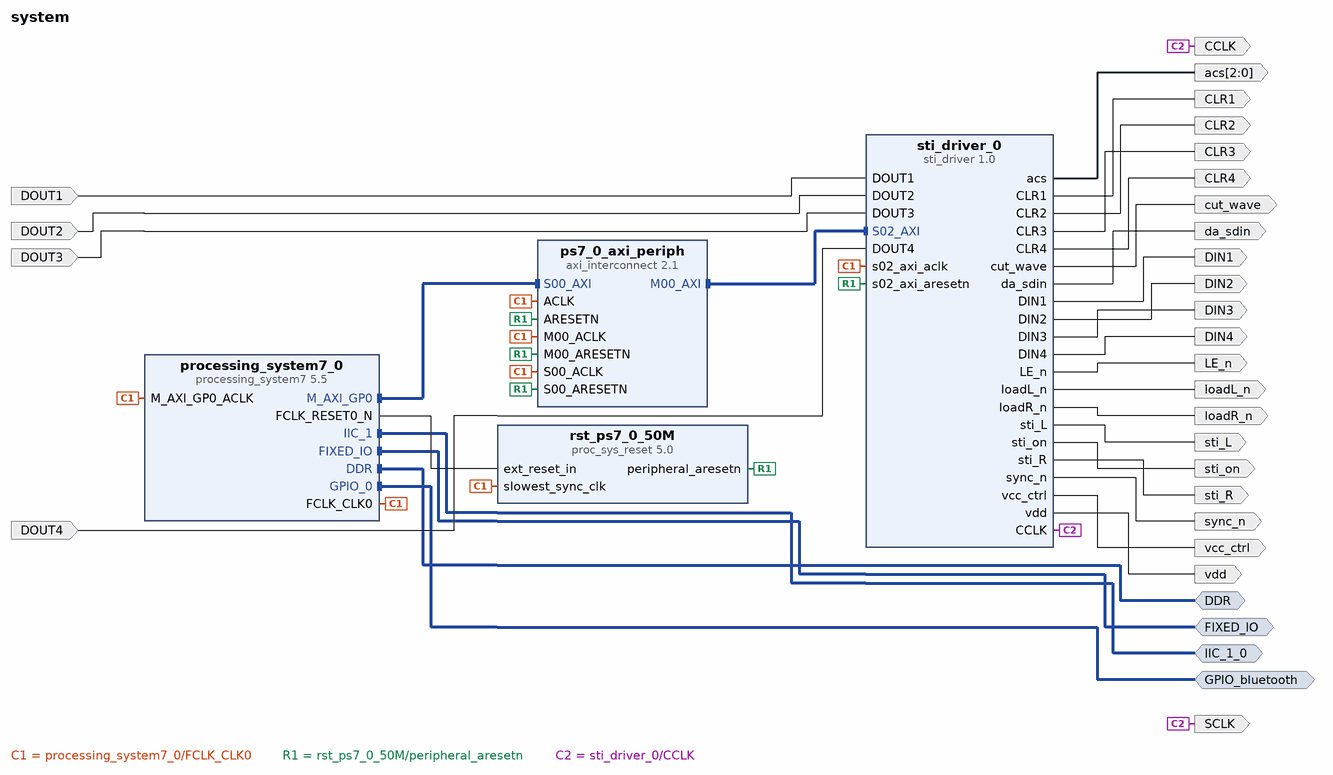
[diagram p0: block diagram of the top level]
# Vivado block design system, xc7z020clg400-2, Vivado 2018.3
create_bd_design system

create_bd_intf_port -mode Master -vlnv xilinx.com:interface:ddrx_rtl:1.0 DDR
create_bd_intf_port -mode Master -vlnv xilinx.com:display_processing_system7:fixedio_rtl:1.0 FIXED_IO
create_bd_intf_port -mode Master -vlnv xilinx.com:interface:gpio_rtl:1.0 GPIO_bluetooth
create_bd_intf_port -mode Master -vlnv xilinx.com:interface:iic_rtl:1.0 IIC_1_0
create_bd_port -dir O vcc_ctrl
create_bd_port -dir O sti_L
create_bd_port -dir O sti_R
create_bd_port -dir O CCLK
create_bd_port -dir O CLR1
create_bd_port -dir O CLR2
create_bd_port -dir O CLR3
create_bd_port -dir O CLR4
create_bd_port -dir O DIN1
create_bd_port -dir O DIN2
create_bd_port -dir O DIN3
create_bd_port -dir O DIN4
create_bd_port -dir I DOUT1
create_bd_port -dir I DOUT2
create_bd_port -dir I DOUT3
create_bd_port -dir I DOUT4
create_bd_port -dir O LE_n
create_bd_port -dir O -from 2 -to 0 acs
create_bd_port -dir O cut_wave
create_bd_port -dir O loadL_n
create_bd_port -dir O loadR_n
create_bd_port -dir O sti_on
create_bd_port -dir O sync_n
create_bd_port -dir O da_sdin
create_bd_port -dir O vdd
create_bd_port -dir O SCLK

create_bd_cell -type ip -vlnv xilinx.com:ip:processing_system7:5.5 processing_system7_0
set_property -dict [list \
  CONFIG.PCW_GPIO_EMIO_GPIO_ENABLE 1 \
  CONFIG.PCW_GPIO_EMIO_GPIO_IO 4 \
  CONFIG.PCW_GPIO_EMIO_GPIO_WIDTH 4 \
  CONFIG.PCW_I2C1_I2C1_IO EMIO \
  CONFIG.PCW_I2C1_PERIPHERAL_ENABLE 1 \
  CONFIG.PCW_I2C_PERIPHERAL_FREQMHZ 111.111115 \
  CONFIG.PCW_PRESET_BANK1_VOLTAGE {LVCMOS 1.8V} \
  CONFIG.PCW_QSPI_GRP_SINGLE_SS_ENABLE 1 \
  CONFIG.PCW_QSPI_GRP_SINGLE_SS_IO {MIO 1 .. 6} \
  CONFIG.PCW_QSPI_PERIPHERAL_ENABLE 1 \
  CONFIG.PCW_QSPI_QSPI_IO {MIO 1 .. 6} \
  CONFIG.PCW_SINGLE_QSPI_DATA_MODE x4 \
  CONFIG.PCW_UART0_PERIPHERAL_ENABLE 1 \
  CONFIG.PCW_UART0_UART0_IO {MIO 14 .. 15} \
  CONFIG.PCW_UART_PERIPHERAL_FREQMHZ 100 \
  CONFIG.PCW_UIPARAM_DDR_PARTNO {MT41J256M16 RE-125} \
] [get_bd_cells processing_system7_0]
# 67 more settings of processing_system7_0 are not shown: defaults, MIO pin electricals, DDR timing, and values the tool derives
create_bd_cell -type ip -vlnv xilinx.com:ip:axi_interconnect:2.1 ps7_0_axi_periph
set_property -dict {CONFIG.NUM_MI 1} [get_bd_cells ps7_0_axi_periph]
create_bd_cell -type ip -vlnv xilinx.com:ip:proc_sys_reset:5.0 rst_ps7_0_50M
create_bd_cell -type ip -vlnv xilinx.com:user:sti_driver:1.0 sti_driver_0

# ---- connections ----

connect_bd_intf_net [get_bd_intf_ports IIC_1_0] [get_bd_intf_pins processing_system7_0/IIC_1]
connect_bd_intf_net [get_bd_intf_ports FIXED_IO] [get_bd_intf_pins processing_system7_0/FIXED_IO]
connect_bd_intf_net [get_bd_intf_ports DDR] [get_bd_intf_pins processing_system7_0/DDR]
connect_bd_intf_net [get_bd_intf_pins processing_system7_0/M_AXI_GP0] [get_bd_intf_pins ps7_0_axi_periph/S00_AXI]
connect_bd_intf_net [get_bd_intf_ports GPIO_bluetooth] [get_bd_intf_pins processing_system7_0/GPIO_0]
connect_bd_intf_net [get_bd_intf_pins ps7_0_axi_periph/M00_AXI] [get_bd_intf_pins sti_driver_0/S02_AXI]
connect_bd_net [get_bd_pins processing_system7_0/FCLK_CLK0] \
  [get_bd_pins processing_system7_0/M_AXI_GP0_ACLK] [get_bd_pins ps7_0_axi_periph/S00_ACLK] \
  [get_bd_pins rst_ps7_0_50M/slowest_sync_clk] [get_bd_pins ps7_0_axi_periph/M00_ACLK] [get_bd_pins ps7_0_axi_periph/ACLK] \
  [get_bd_pins sti_driver_0/s02_axi_aclk]
connect_bd_net [get_bd_pins processing_system7_0/FCLK_RESET0_N] [get_bd_pins rst_ps7_0_50M/ext_reset_in]
connect_bd_net [get_bd_pins rst_ps7_0_50M/peripheral_aresetn] \
  [get_bd_pins ps7_0_axi_periph/S00_ARESETN] [get_bd_pins ps7_0_axi_periph/M00_ARESETN] \
  [get_bd_pins ps7_0_axi_periph/ARESETN] [get_bd_pins sti_driver_0/s02_axi_aresetn]
connect_bd_net [get_bd_pins sti_driver_0/vcc_ctrl] [get_bd_ports vcc_ctrl]
connect_bd_net [get_bd_pins sti_driver_0/sti_L] [get_bd_ports sti_L]
connect_bd_net [get_bd_pins sti_driver_0/sti_R] [get_bd_ports sti_R]
connect_bd_net [get_bd_pins sti_driver_0/CCLK] [get_bd_ports CCLK] [get_bd_ports SCLK]
connect_bd_net [get_bd_pins sti_driver_0/CLR1] [get_bd_ports CLR1]
connect_bd_net [get_bd_pins sti_driver_0/CLR2] [get_bd_ports CLR2]
connect_bd_net [get_bd_pins sti_driver_0/CLR3] [get_bd_ports CLR3]
connect_bd_net [get_bd_pins sti_driver_0/CLR4] [get_bd_ports CLR4]
connect_bd_net [get_bd_pins sti_driver_0/DIN1] [get_bd_ports DIN1]
connect_bd_net [get_bd_pins sti_driver_0/DIN2] [get_bd_ports DIN2]
connect_bd_net [get_bd_pins sti_driver_0/DIN3] [get_bd_ports DIN3]
connect_bd_net [get_bd_pins sti_driver_0/DIN4] [get_bd_ports DIN4]
connect_bd_net -net DOUT1_0_1 [get_bd_ports DOUT1] [get_bd_pins sti_driver_0/DOUT1]
connect_bd_net -net DOUT2_0_1 [get_bd_ports DOUT2] [get_bd_pins sti_driver_0/DOUT2]
connect_bd_net -net DOUT3_0_1 [get_bd_ports DOUT3] [get_bd_pins sti_driver_0/DOUT3]
connect_bd_net -net DOUT4_0_1 [get_bd_ports DOUT4] [get_bd_pins sti_driver_0/DOUT4]
connect_bd_net [get_bd_pins sti_driver_0/LE_n] [get_bd_ports LE_n]
connect_bd_net [get_bd_pins sti_driver_0/acs] [get_bd_ports acs]
connect_bd_net [get_bd_pins sti_driver_0/cut_wave] [get_bd_ports cut_wave]
connect_bd_net [get_bd_pins sti_driver_0/loadR_n] [get_bd_ports loadR_n]
connect_bd_net [get_bd_pins sti_driver_0/sti_on] [get_bd_ports sti_on]
connect_bd_net [get_bd_pins sti_driver_0/loadL_n] [get_bd_ports loadL_n]
connect_bd_net [get_bd_pins sti_driver_0/sync_n] [get_bd_ports sync_n]
connect_bd_net [get_bd_pins sti_driver_0/da_sdin] [get_bd_ports da_sdin]
connect_bd_net [get_bd_pins sti_driver_0/vdd] [get_bd_ports vdd]

# ---- address map ----
assign_bd_address -offset 0x43C00000 -range 64K -target_address_space [get_bd_addr_spaces processing_system7_0/Data] [get_bd_addr_segs sti_driver_0/S02_AXI/S02_AXI_reg]

validate_bd_design
save_bd_design
